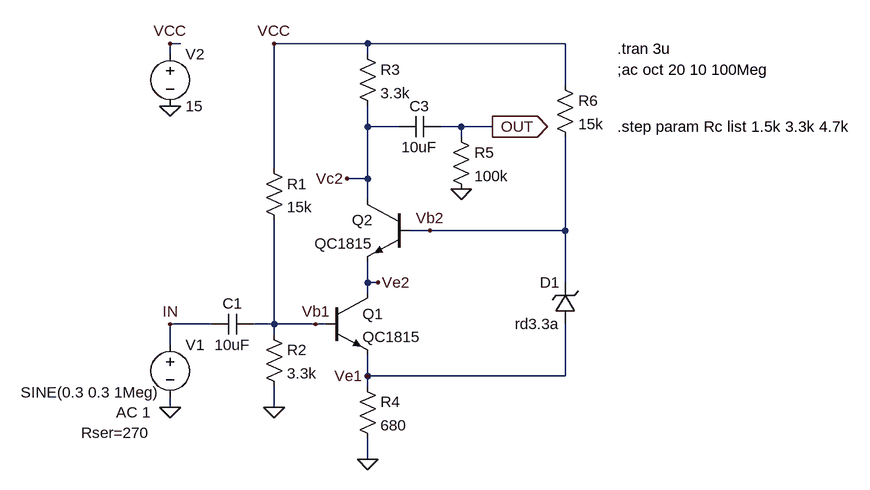
[diagram p0: schematic Cascode_BootStrap-r3.3k.asc]
Cascode_BootStrap-r3.3k.asc, the LTspice schematic file:
Version 4
SHEET 1 1220 696
WIRE 64 -96 48 -96
WIRE 352 -96 208 -96
WIRE 656 -96 352 -96
WIRE 48 -80 48 -96
WIRE 352 -80 352 -96
WIRE 656 -32 656 -96
WIRE 352 32 352 0
WIRE 400 32 352 32
WIRE 496 32 464 32
WIRE 544 32 496 32
WIRE 496 48 496 32
WIRE 208 96 208 -96
WIRE 352 112 352 32
WIRE 352 112 320 112
WIRE 352 144 352 112
WIRE 448 192 416 192
WIRE 656 192 656 48
WIRE 656 192 448 192
WIRE 352 272 352 240
WIRE 368 272 352 272
WIRE 656 272 656 192
WIRE 352 288 352 272
WIRE 112 336 48 336
WIRE 208 336 208 176
WIRE 208 336 176 336
WIRE 272 336 208 336
WIRE 288 336 272 336
WIRE 208 352 208 336
WIRE 48 368 48 336
WIRE 352 416 352 384
WIRE 656 416 656 336
WIRE 656 416 352 416
WIRE 352 432 352 416
WIRE 48 464 48 448
WIRE 208 464 208 432
WIRE 352 544 352 512
FLAG 208 464 0
FLAG 48 464 0
FLAG 48 336 IN
FLAG 544 32 OUT
IOPIN 544 32 Out
FLAG 48 0 0
FLAG 48 -96 VCC
FLAG 208 -96 VCC
FLAG 352 544 0
FLAG 272 336 Vb1
FLAG 352 416 Ve1
FLAG 368 272 Ve2
FLAG 448 192 Vb2
FLAG 496 128 0
FLAG 320 112 Vc2
SYMBOL npn 416 144 M0
SYMATTR InstName Q2
SYMATTR Value QC1815
SYMBOL res 192 80 R0
SYMATTR InstName R1
SYMATTR Value 15k
SYMBOL res 192 336 R0
SYMATTR InstName R2
SYMATTR Value 3.3k
SYMBOL res 336 -96 R0
SYMATTR InstName R3
SYMATTR Value 3.3k
SYMBOL res 336 416 R0
SYMATTR InstName R4
SYMATTR Value 680
SYMBOL cap 176 320 R90
WINDOW 0 0 32 VBottom 2
WINDOW 3 32 32 VTop 2
SYMATTR InstName C1
SYMATTR Value 10uF
SYMBOL voltage 48 352 R0
WINDOW 123 -83 120 Left 2
WINDOW 39 -137 151 Left 2
WINDOW 3 -230 89 Left 2
SYMATTR Value2 AC 1
SYMATTR SpiceLine Rser=270
SYMATTR Value SINE(0.3 0.3 1Meg)
SYMATTR InstName V1
SYMBOL voltage 48 -96 R0
SYMATTR InstName V2
SYMATTR Value 15
SYMBOL npn 288 288 R0
SYMATTR InstName Q1
SYMATTR Value QC1815
SYMBOL res 640 -48 R0
SYMATTR InstName R6
SYMATTR Value 15k
SYMBOL cap 464 16 R90
WINDOW 0 0 32 VBottom 2
WINDOW 3 32 32 VTop 2
SYMATTR InstName C3
SYMATTR Value 10uF
SYMBOL zener 672 336 R180
WINDOW 0 24 64 Left 2
WINDOW 3 24 0 Left 2
SYMATTR InstName D1
SYMATTR Value rd3.3a
SYMBOL res 480 32 R0
SYMATTR InstName R5
SYMATTR Value 100k
TEXT 736 -88 Left 2 !.tran 3u
TEXT 736 -56 Left 2 !;ac oct 20 10 100Meg
TEXT 736 32 Left 2 !.step param Rc list 1.5k 3.3k 4.7k

The netlist it stands for:
* Cascode_BootStrap-r3.3k.asc
Q2 Vc2 Vb2 Ve2 0 QC1815
R1 VCC Vb1 15k
R2 Vb1 0 3.3k
R3 VCC Vc2 3.3k
R4 Ve1 0 680
C1 Vb1 IN 10uF
V1 IN 0 SINE(0.3 0.3 1Meg) AC 1 Rser=270
V2 VCC 0 15
Q1 Ve2 Vb1 Ve1 0 QC1815
R6 VCC Vb2 15k
C3 OUT Vc2 10uF
D1 Ve1 Vb2 rd3.3a
R5 OUT 0 100k
.model D D
.lib standard.dio
.model NPN NPN
.model PNP PNP
.lib standard.bjt
.tran 3u
;ac oct 20 10 100Meg
.step param Rc list 1.5k 3.3k 4.7k
.backanno
.end